# Altium schematic sheet MercurialSDR_FPGA_P&P.SchDoc: MercurialSDR - iCE Power & Program.
size A4; Author: Andres Hojnadel; DrawnBy: Andres Hojnadel; Revision: Rev2.0; SheetNumber: 4; SheetTotal: 6; ProjectName: MercurialSDR
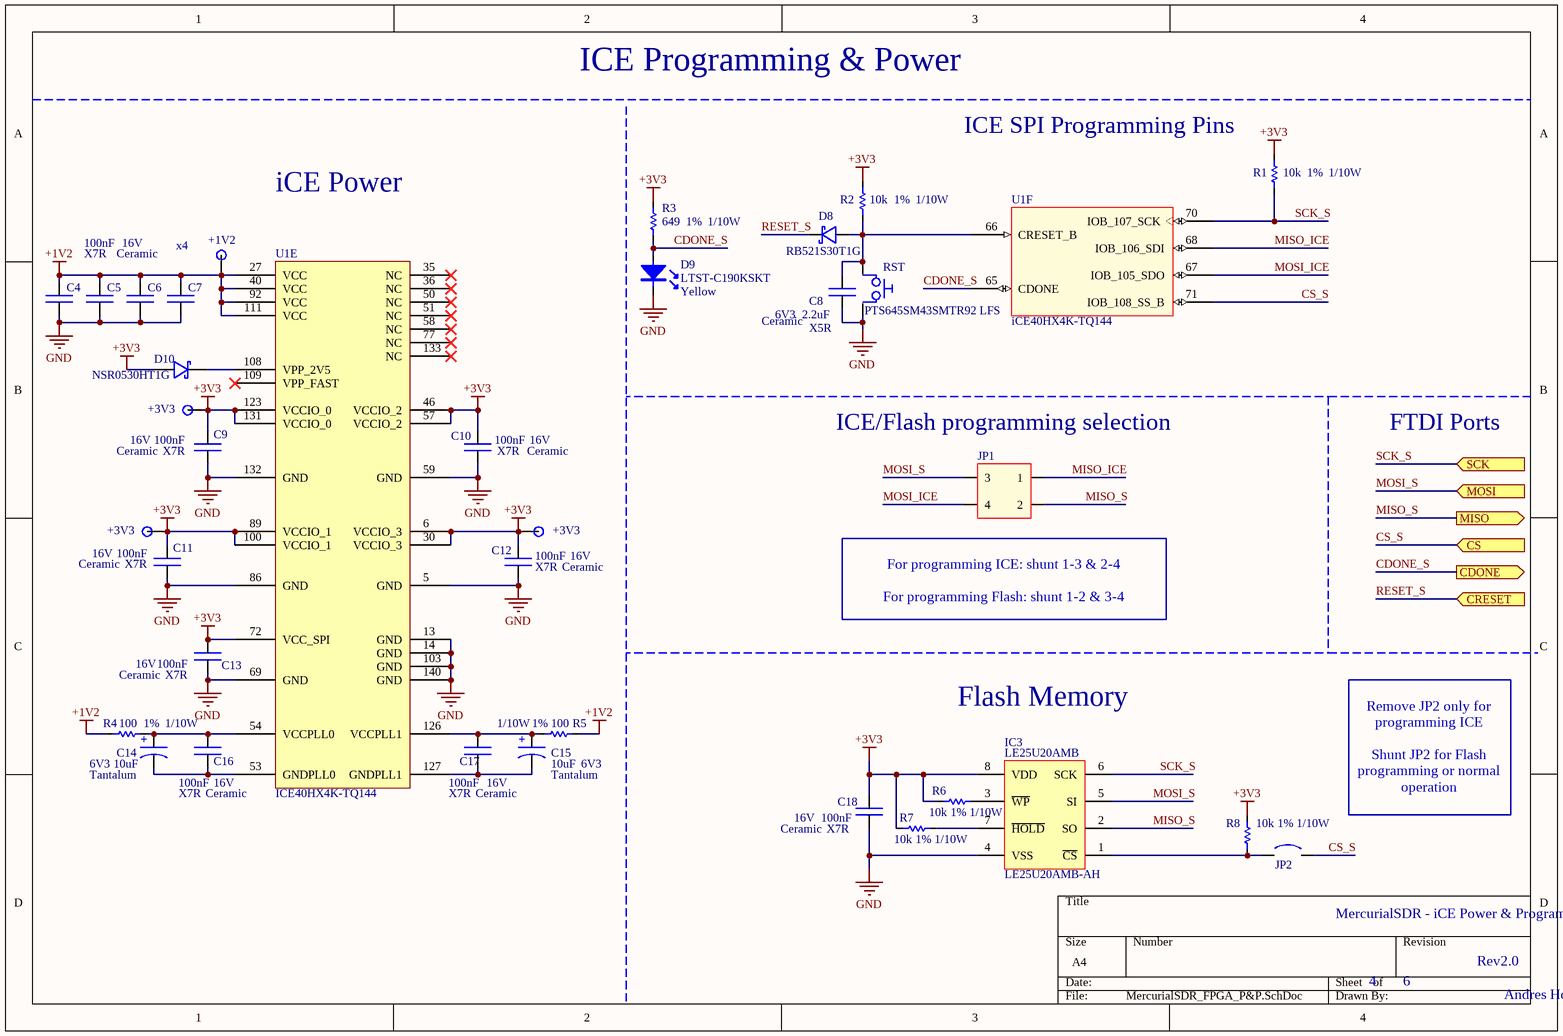
[diagram p0: MercurialSDR_FPGA_P&P.SchDoc]

## Parts
C4  Capacitor  [CAP_0603]  (value not drawn)
C5  Capacitor  [CAP_0603]  (value not drawn)
C6  Capacitor  [CAP_0603]  (value not drawn)
C7  value 100nF  Temp Coef: X7R  VR: 16V  Material: Ceramic  [CAP_0603]  (hidden comment: Capacitor)
C8  value 2.2uF  Temp Coef: X5R  VR: 6V3  Material: Ceramic  [CAP_0603]  (hidden comment: Capacitor)
C9  value 100nF  Temp Coef: X7R  VR: 16V  Material: Ceramic  [CAP_0603]  (hidden comment: Capacitor)
C10  value 100nF  Temp Coef: X7R  VR: 16V  Material: Ceramic  [CAP_0603]  (hidden comment: Capacitor)
C11  value 100nF  Temp Coef: X7R  VR: 16V  Material: Ceramic  [CAP_0603]  (hidden comment: Capacitor)
C12  value 100nF  Temp Coef: X7R  VR: 16V  Material: Ceramic  [CAP_0603]  (hidden comment: Capacitor)
C13  value 100nF  Temp Coef: X7R  VR: 16V  Material: Ceramic  [CAP_0603]  (hidden comment: Capacitor)
C14  value 10uF  VR: 6V3  Material: Tantalum  [CAP_TANT_1206]  (hidden comment: Capacitor Polarizado)
C15  value 10uF  VR: 6V3  Material: Tantalum  [CAP_TANT_1206]  (hidden comment: Capacitor Polarizado)
C16  value 100nF  Temp Coef: X7R  VR: 16V  Material: Ceramic  [CAP_0603]  (hidden comment: Capacitor)
C17  value 100nF  Temp Coef: X7R  VR: 16V  Material: Ceramic  [CAP_0603]  (hidden comment: Capacitor)
C18  value 100nF  Temp Coef: X7R  VR: 16V  Material: Ceramic  [CAP_0603]  (hidden comment: Capacitor)
D8  Part Number: RB521S30T1G  [SOD-523]  (hidden comment: Schottky Diode)
D9  Color: Yellow  Part Number: LTST-C190KSKT  [LED_0603]  (hidden comment: Led)
D10  Part Number: NSR0530HT1G  [SOD-323]  (hidden comment: Schottky Diode)
IC3  LE25U20AMB  Part Number: LE25U20AMB-AH  [SOIC-8]
JP1  Jumper  [Jumper 2x2]  (value not drawn)
JP2  Jumper  [Jumper 2x1]  (value not drawn)
R1  value 10k  Power: 1/10W  Tolerance: 1%  [RES_0603]  (hidden comment: Resistor SMD)
R2  value 10k  Power: 1/10W  Tolerance: 1%  [RES_0603]  (hidden comment: Resistor SMD)
R3  value 649  Power: 1/10W  Tolerance: 1%  [RES_0603]  (hidden comment: Resistor SMD)
R4  value 100  Power: 1/10W  Tolerance: 1%  [RES_0603]  (hidden comment: Resistor SMD)
R5  value 100  Power: 1/10W  Tolerance: 1%  [RES_0603]  (hidden comment: Resistor SMD)
R6  value 10k  Power: 1/10W  Tolerance: 1%  [RES_0603]  (hidden comment: Resistor SMD)
R7  value 10k  Power: 1/10W  Tolerance: 1%  [RES_0603]  (hidden comment: Resistor SMD)
R8  value 10k  Power: 1/10W  Tolerance: 1%  [RES_0603]  (hidden comment: Resistor SMD)
SW4  Part Number: PTS645SM43SMTR92 LFS  Serigrafia: RST  [SWITCH_6X6mm]  (hidden comment: Pulsador)
TP3  TP Name: +1V2  [TP_TOP]  (hidden comment: Test Point)
TP4  TP Name: +3V3  [TP_TOP]  (hidden comment: Test Point)
TP6  TP Name: +3V3  [TP_TOP]  (hidden comment: Test Point)
TP7  TP Name: +3V3  [TP_TOP]  (hidden comment: Test Point)
U1  ICE40HX4K-TQ144  [LATC-TQFP-144_L]  (parts E,F of 6)

## Ports
CDONE (out), CRESET (in), CS (in), MISO (out), MOSI (in), SCK (in)

## Nets
+1V2: C4.1 C5.1 C6.1 C7.1 R4.2 R5.1 TP3.1(TP?) U1.27(VCC) U1.40(VCC) U1.92(VCC) U1.111(VCC)
+3V3: C9.2 C10.2 C11.2 C12.2 C13.2 C18.2 D10.1(A) IC3.8(VDD) R1.1 R2.1 R3.1 R6.1 R7.1 R8.2 TP4.1(TP?) TP6.1(TP?) TP7.1(TP?) U1.6(VCCIO_3) U1.30(VCCIO_3) U1.46(VCCIO_2) U1.57(VCCIO_2) U1.72(VCC_SPI) U1.89(VCCIO_1) U1.100(VCCIO_1) U1.123(VCCIO_0) U1.131(VCCIO_0)
GND: C4.2 C5.2 C6.2 C7.2 C8.2 C9.1 C10.1 C11.1 C12.1 C13.1 C18.1 D9.2(K) IC3.4(VSS) SW4.4 U1.5(GND) U1.13(GND) U1.14(GND) U1.59(GND) U1.69(GND) U1.86(GND) U1.103(GND) U1.132(GND) U1.140(GND)
CDONE_S: D9.1(A) R3.2 U1.65(CDONE) ; port CDONE
CS_S: JP2.2 U1.71(IOB_108_SS_B) ; port CS
MISO_ICE: JP1.1 U1.68(IOB_106_SDI)
MISO_S: IC3.2(SO) JP1.2 ; port MISO
MOSI_ICE: JP1.4 U1.67(IOB_105_SDO)
MOSI_S: IC3.5(SI) JP1.3 ; port MOSI
RESET_S: D8.2(K) ; port CRESET
SCK_S: IC3.6(SCK) R1.2 U1.70(IOB_107_SCK) ; port SCK
NetC8_1: C8.1 D8.1(A) R2.2 SW4.1 U1.66(CRESET_B)
NetC14_1: C14.1 C16.1 R4.1 U1.54(VCCPLL0)
NetC14_2: C14.2 C16.2 U1.53(GNDPLL0)
NetC15_1: C15.1 C17.1 R5.2 U1.126(VCCPLL1)
NetC15_2: C15.2 C17.2 U1.127(GNDPLL1)
NetD10_2: D10.2(K) U1.108(VPP_2V5)
NetIC3_1: IC3.1(~{CS}) JP2.1 R8.1
NetIC3_3: IC3.3(~{WP}) R6.2
NetIC3_7: IC3.7(~{HOLD}) R7.2

Not connected (* = marked no-connect by the designer): SW4 2 3; U1 35(NC)* 36(NC)* 50(NC)* 51(NC)* 58(NC)* 77(NC)* 109(VPP_FAST)* 133(NC)*

## Notes on the sheet
- ICE Programming & Power
- (near R1) ICE SPI Programming Pins
- x4
- iCE Power
- (near JP1) ICE/Flash programming selection
- FTDI Ports
- (near JP1) For programming ICE: shunt 1-3 & 2-4
  For programming Flash: shunt 1-2 & 3-4
- Flash Memory
- Remove JP2 only for programming ICE
  Shunt JP2 for Flash programming or normal operation
- (in symbol Cap Pol) +

## Library data of the parts
C4-C6 = Cap: Capacitor no polarizado; Part Number: CL10B104KO8NNNC; Value: 100nF; Temp Coef: X7R; VR: 16V; Material: Ceramic
C7 C9-C13 C16-C18 = Cap: Capacitor no polarizado; Part Number: CL10B104KO8NNNC
C8 = Cap: Capacitor no polarizado; Part Number: CL10A225KQ8NNNC
C14 C15 = Cap Pol: Part Number: TAJA106K006RNJ; Temp Coef: *
D8 D10 = Diodo_Schottky: Diodo Schottkey; In: *; VR: *
IC3 = LE25U20AMB: Flash Memmory SPI (256Kx8)
JP1 = Jumper 2x2
R1 R2 R6-R8 = Res: Resistor; Part Number: CR0603-FX-1002EAS
R3 = Res: Resistor; Part Number: RC0603FR-07649RL
R4 R5 = Res: Resistor; Part Number: CR0603-FX-1000ELF
U1 = ICE40HX4K-TQ144: iCE40 HX4K Series FPGA Family, 3520 Logic Cells, 1.2 V Core, 80 K Embedded RAM Bits, 144-pin TQFP, Pb-Free, Tray; Manufacturer: Lattice Semiconductor; Phase-Locked Loops: 2; Supply Voltage: 1.2V; Logic Cells: 3520; Embedded RAM Bits: 80K; ComponentLink1Description: Manufacturer URL; ComponentLink2Description: Datasheet; DatasheetVersion: Rev. 02.9; Mounting Technology: Surface Mount; ComponentLink3URL: http://www.latticesemi.com/lit/docs/package/pkg.pdf; ComponentLink3Description: Package Specification; ComponentLink1URL: http://www.latticesemi.com/en; ComponentLink2URL: http://www.latticesemi.com/~/media/Documents/DataSheets/iCE/iCE40LPHXFamilyDataSheet.pdf; PackageReference: TQFP-144; Packing: Tray; Part Number: ICE40HX4K-TQ144; PackageDescription: 144-Pin Thin Quad Flat Package, Body 20 x 20 mm, Pitch 0.5 mm; PackageVersion: Rev. 03.9, 02/2013; RoHS: TRUE
JP2 = Jumper: Part Number: *